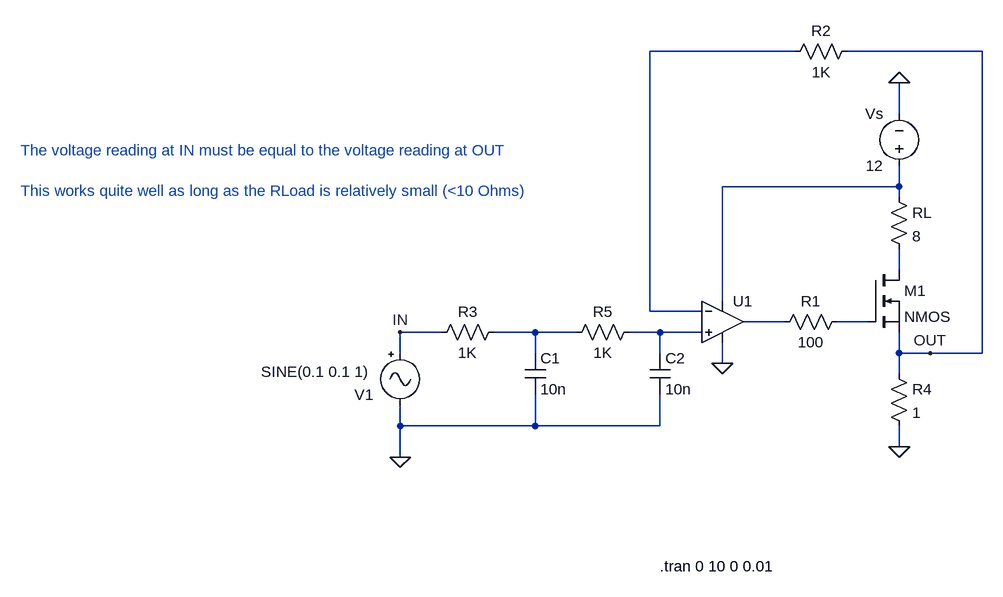
[diagram p0: schematic with_nmos.asc]
with_nmos.asc, the LTspice schematic file:
Version 4
SHEET 1 1176 680
WIRE 240 -272 16 -272
WIRE 528 -272 320 -272
WIRE 400 -176 400 -224
WIRE 400 -64 400 -96
WIRE 400 -64 128 -64
WIRE 400 -48 400 -64
WIRE 400 64 400 32
WIRE 128 112 128 -64
WIRE 16 128 16 -272
WIRE 96 128 16 128
WIRE 224 144 160 144
WIRE 352 144 304 144
WIRE -304 160 -368 160
WIRE -160 160 -224 160
WIRE -96 160 -160 160
WIRE 32 160 -16 160
WIRE 96 160 32 160
WIRE -368 192 -368 160
WIRE -160 192 -160 160
WIRE 32 192 32 160
WIRE 400 192 400 160
WIRE 448 192 400 192
WIRE 528 192 528 -272
WIRE 528 192 448 192
WIRE 128 208 128 176
WIRE 400 224 400 192
WIRE -368 304 -368 272
WIRE -160 304 -160 256
WIRE -160 304 -368 304
WIRE 32 304 32 256
WIRE 32 304 -160 304
WIRE 400 336 400 304
WIRE -368 352 -368 304
FLAG -368 352 0
FLAG 128 208 0
FLAG 400 -224 0
FLAG 400 336 0
FLAG -368 160 IN
FLAG 448 192 OUT
SYMBOL res 384 -64 R0
SYMATTR InstName RL
SYMATTR Value 8
SYMBOL nmos 352 64 R0
SYMATTR InstName M1
SYMBOL voltage 400 -80 R180
WINDOW 0 24 96 Left 2
WINDOW 3 24 16 Left 2
WINDOW 123 0 0 Left 0
WINDOW 39 0 0 Left 0
SYMATTR InstName Vs
SYMATTR Value 12
SYMBOL OpAmps\\UniversalOpAmp 128 144 R0
SYMATTR InstName U1
SYMBOL Misc\\signal -368 176 R0
WINDOW 123 0 0 Left 0
WINDOW 39 0 0 Left 0
WINDOW 0 -70 80 Left 2
WINDOW 3 -214 45 Left 2
SYMATTR InstName V1
SYMATTR Value SINE(0.1 0.1 1)
SYMBOL res 384 208 R0
SYMATTR InstName R4
SYMATTR Value 1
SYMBOL res 320 128 R90
WINDOW 0 0 56 VBottom 2
WINDOW 3 32 56 VTop 2
SYMATTR InstName R1
SYMATTR Value 100
SYMBOL res 336 -288 R90
WINDOW 0 0 56 VBottom 2
WINDOW 3 32 56 VTop 2
SYMATTR InstName R2
SYMATTR Value 1K
SYMBOL cap -176 192 R0
SYMATTR InstName C1
SYMATTR Value 10n
SYMBOL res -208 144 R90
WINDOW 0 0 56 VBottom 2
WINDOW 3 32 56 VTop 2
SYMATTR InstName R3
SYMATTR Value 1K
SYMBOL res 0 144 R90
WINDOW 0 0 56 VBottom 2
WINDOW 3 32 56 VTop 2
SYMATTR InstName R5
SYMATTR Value 1K
SYMBOL cap 16 192 R0
SYMATTR InstName C2
SYMATTR Value 10n
TEXT 32 520 Left 2 !.tran 0 10 0 0.01
TEXT -952 -120 Left 2 ;The voltage reading at IN must be equal to the voltage reading at OUT\n \nThis works quite well as long as the RLoad is relatively small (<10 Ohms)

The netlist it stands for:
* with_nmos.asc
RL N002 N003 8
M1 N003 N005 OUT OUT NMOS
Vs N002 0 12
XU1 N007 N001 N002 0 N004 level1 Avol=1Meg GBW=10Meg Vos=0 En=0 Enk=0 In=0 Ink=0 Rin=500Meg  ; pins In+ In- V+ V- OUT
V1 IN 0 SINE(0.1 0.1 1)
R4 OUT 0 1
R1 N005 N004 100
R2 OUT N001 1K
C1 N006 0 10n
R3 N006 IN 1K
R5 N007 N006 1K
C2 N007 0 10n
.model NMOS NMOS
.model PMOS PMOS
.lib standard.mos
.tran 0 10 0 0.01
* The voltage reading at IN must be equal to the voltage reading at OUT
* This works quite well as long as the RLoad is relatively small (<10 Ohms)
.lib UniversalOpAmp1.lib
.backanno
.end